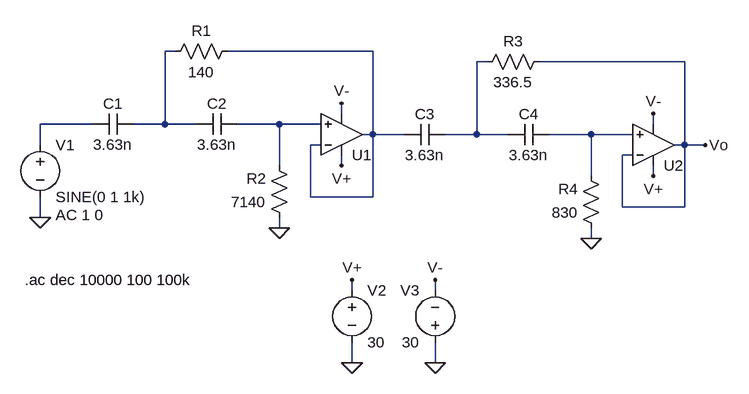
[diagram p0: schematic Ex10.asc]
Ex10.asc, the LTspice schematic file:
Version 4
SHEET 1 1088 680
WIRE 224 48 208 48
WIRE 528 48 304 48
WIRE 704 64 688 64
WIRE 1008 64 784 64
WIRE 480 144 480 128
WIRE 96 160 16 160
WIRE 208 160 208 48
WIRE 208 160 160 160
WIRE 256 160 208 160
WIRE 384 160 320 160
WIRE 448 160 384 160
WIRE 960 160 960 144
WIRE 528 176 528 48
WIRE 528 176 512 176
WIRE 576 176 528 176
WIRE 688 176 688 64
WIRE 688 176 640 176
WIRE 736 176 688 176
WIRE 864 176 800 176
WIRE 928 176 864 176
WIRE 16 192 16 160
WIRE 448 192 432 192
WIRE 1008 192 1008 64
WIRE 1008 192 992 192
WIRE 1040 192 1008 192
WIRE 928 208 912 208
WIRE 384 224 384 160
WIRE 480 224 480 208
WIRE 864 240 864 176
WIRE 960 240 960 224
WIRE 432 272 432 192
WIRE 528 272 528 176
WIRE 528 272 432 272
WIRE 912 288 912 208
WIRE 1008 288 1008 192
WIRE 1008 288 912 288
WIRE 16 304 16 272
WIRE 384 320 384 304
WIRE 864 336 864 320
WIRE 496 416 496 400
WIRE 624 416 624 400
WIRE 496 528 496 496
WIRE 624 528 624 496
FLAG 480 128 V-
FLAG 480 224 V+
FLAG 384 320 0
FLAG 960 144 V-
FLAG 960 240 V+
FLAG 864 336 0
FLAG 1040 192 Vo
FLAG 16 304 0
FLAG 496 528 0
FLAG 624 528 0
FLAG 624 400 V-
FLAG 496 400 V+
SYMBOL res 208 64 R270
WINDOW 0 32 56 VTop 2
WINDOW 3 0 56 VBottom 2
SYMATTR InstName R1
SYMATTR Value 140
SYMBOL res 400 320 R180
WINDOW 0 36 76 Left 2
WINDOW 3 36 40 Left 2
SYMATTR InstName R2
SYMATTR Value 7140
SYMBOL cap 96 176 R270
WINDOW 0 32 32 VTop 2
WINDOW 3 0 32 VBottom 2
SYMATTR InstName C1
SYMATTR Value 3.63n
SYMBOL cap 320 144 R90
WINDOW 0 0 32 VBottom 2
WINDOW 3 32 32 VTop 2
SYMATTR InstName C2
SYMATTR Value 3.63n
SYMBOL OpAmps\\UniversalOpAmp 480 176 M180
SYMATTR InstName U1
SYMATTR Value2 Avol=1000000Meg GBW=10000000Meg Vos=0
SYMATTR SpiceLine En=0 Enk=0 In=0 Ink=0 Rin=500000000Meg
SYMBOL res 800 48 R90
WINDOW 0 0 56 VBottom 2
WINDOW 3 32 56 VTop 2
SYMATTR InstName R3
SYMATTR Value 336.5
SYMBOL res 880 336 R180
WINDOW 0 36 76 Left 2
WINDOW 3 36 40 Left 2
SYMATTR InstName R4
SYMATTR Value 830
SYMBOL cap 640 160 R90
WINDOW 0 0 32 VBottom 2
WINDOW 3 32 32 VTop 2
SYMATTR InstName C3
SYMATTR Value 3.63n
SYMBOL cap 800 160 R90
WINDOW 0 0 32 VBottom 2
WINDOW 3 32 32 VTop 2
SYMATTR InstName C4
SYMATTR Value 3.63n
SYMBOL OpAmps\\UniversalOpAmp 960 192 M180
SYMATTR InstName U2
SYMATTR Value2 Avol=1000000Meg GBW=10000000Meg Vos=0
SYMATTR SpiceLine En=0 Enk=0 In=0 Ink=0 Rin=500000000Meg
SYMBOL voltage 16 176 R0
WINDOW 123 24 124 Left 2
WINDOW 39 0 0 Left 0
SYMATTR InstName V1
SYMATTR Value SINE(0 1 1k)
SYMATTR Value2 AC 1 0
SYMBOL voltage 496 400 R0
WINDOW 123 0 0 Left 0
WINDOW 39 0 0 Left 0
SYMATTR InstName V2
SYMATTR Value 30
SYMBOL voltage 624 512 R180
WINDOW 0 24 96 Left 2
WINDOW 3 24 16 Left 2
WINDOW 123 0 0 Left 0
WINDOW 39 0 0 Left 0
SYMATTR InstName V3
SYMATTR Value 30
TEXT -8 400 Left 2 !.ac dec 10000 100 100k

The netlist it stands for:
* Ex10.asc
R1 N001 N002 140
R2 0 N005 7140
C1 N004 N001 3.63n
C2 N005 N001 3.63n
XU1 N005 N002 V+ V- N002 level1 Avol=1000000Meg GBW=10000000Meg Vos=0 En=0 Enk=0 In=0 Ink=0 Rin=500000000Meg  ; pins In+ In- V+ V- OUT
R3 Vo N003 336.5
R4 0 N006 830
C3 N003 N002 3.63n
C4 N006 N003 3.63n
XU2 N006 Vo V+ V- Vo level1 Avol=1000000Meg GBW=10000000Meg Vos=0 En=0 Enk=0 In=0 Ink=0 Rin=500000000Meg  ; pins In+ In- V+ V- OUT
V1 N004 0 SINE(0 1 1k) AC 1 0
V2 V+ 0 30
V3 0 V- 30
.ac dec 10000 100 100k
.lib UniversalOpAmp1.lib
.backanno
.end